# EAGLE design 16 ch sample-and-hold card v4_1_1 (EAGLE 9.6.2)
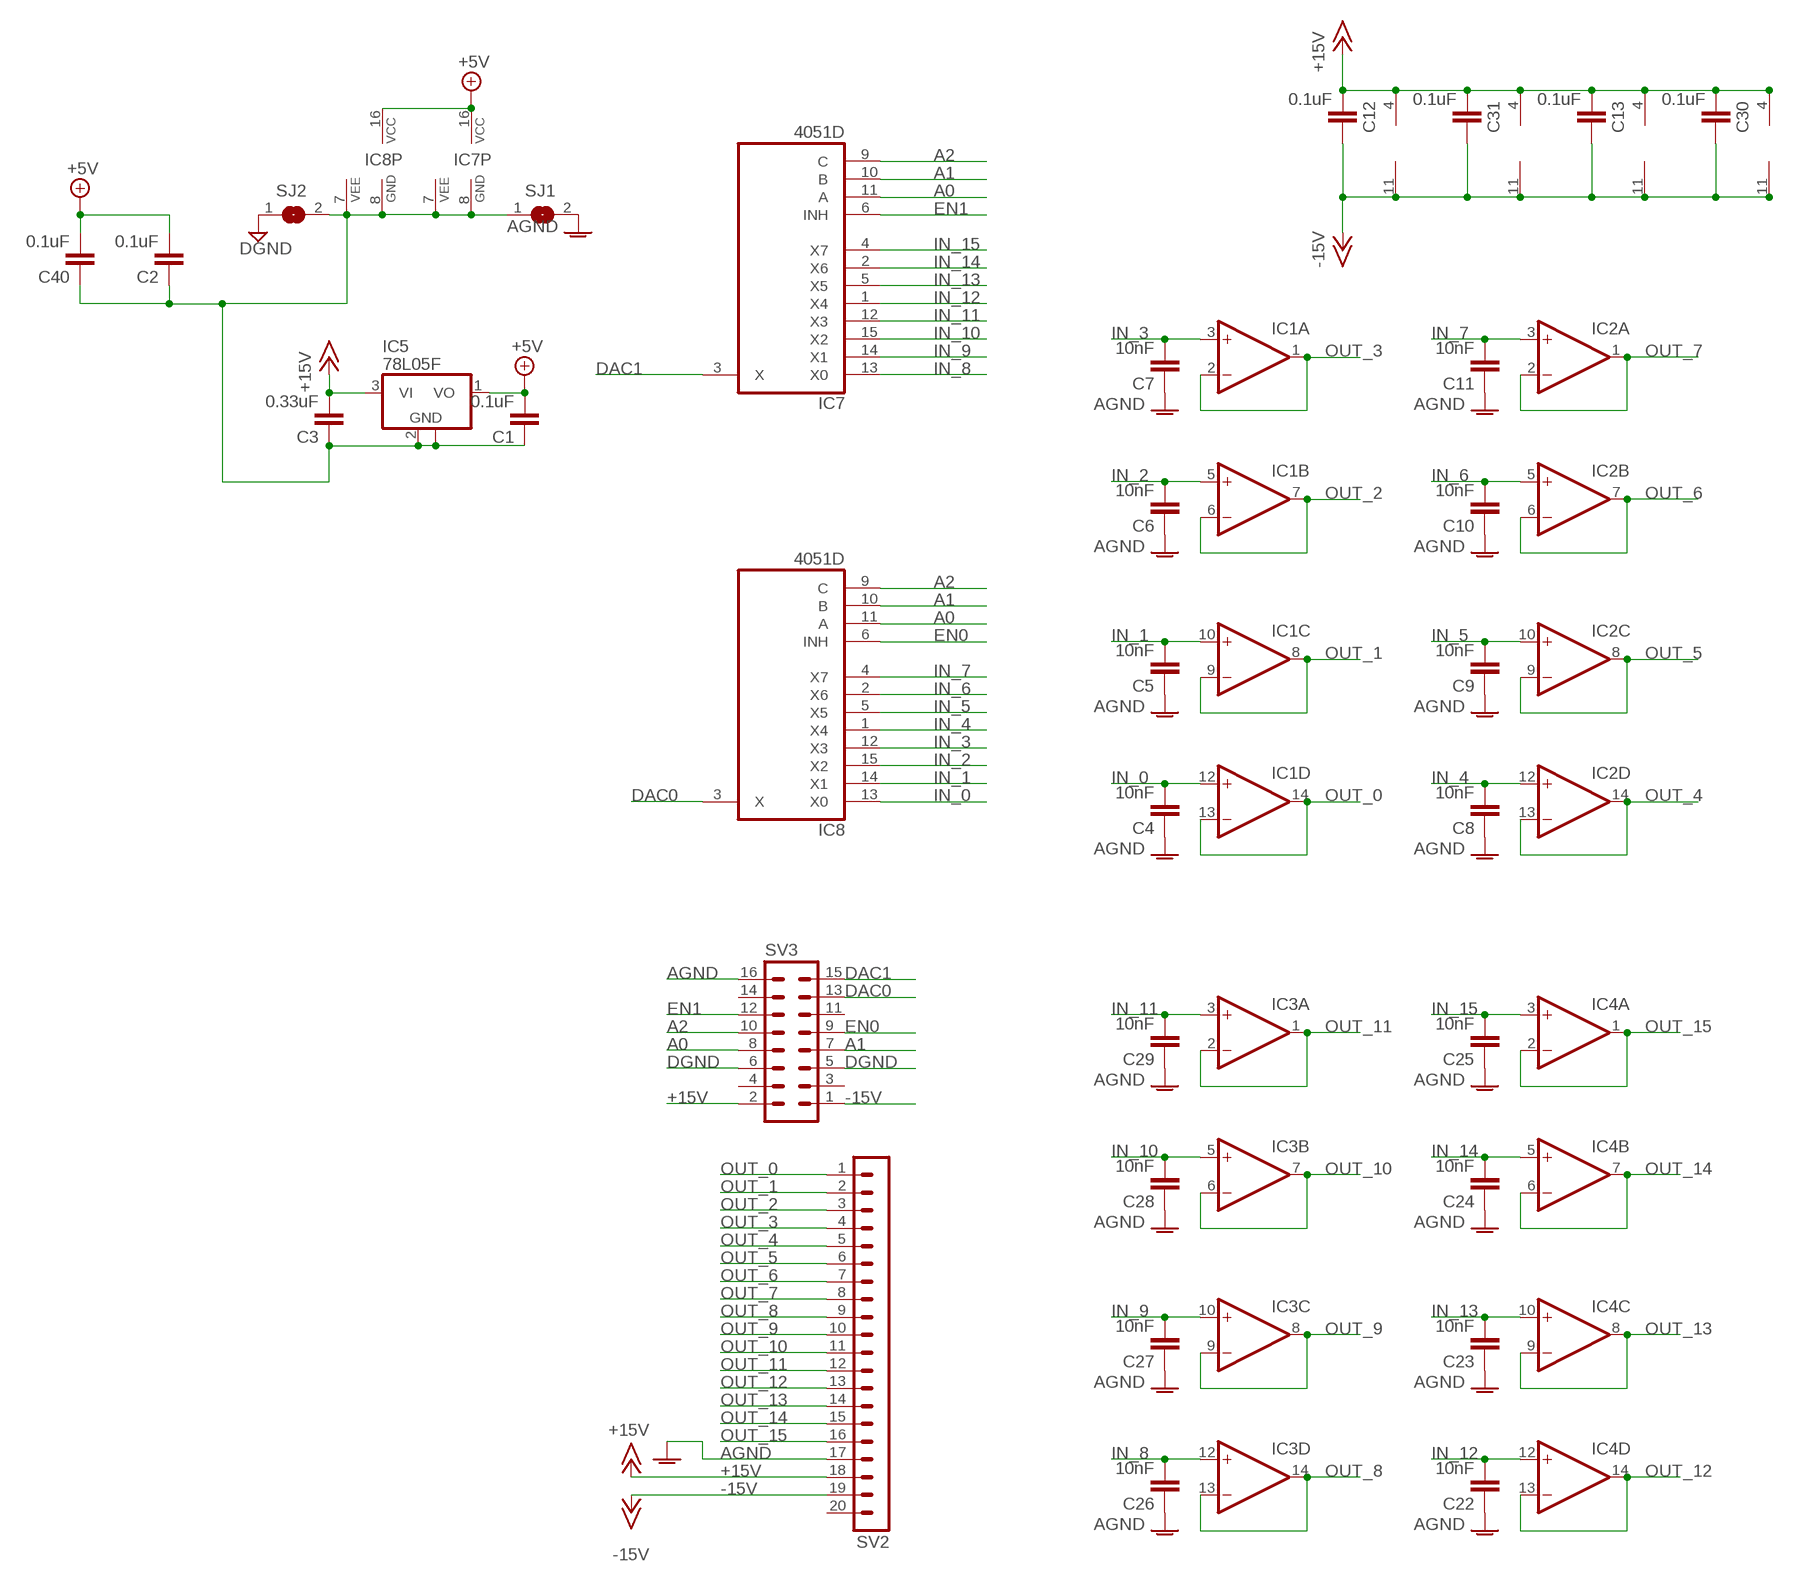
[diagram p0: schematic, sheet 1]

## Parts
C1  0.1uF  C-EUC0603  [C0603]
C2  0.1uF  C-EUC0603  [C0603]
C3  0.33uF  C-EUC0603  [C0603]
C4  10nF  C-EUC0805  [C0805]
C5  10nF  C-EUC0805  [C0805]
C6  10nF  C-EUC0805  [C0805]
C7  10nF  C-EUC0805  [C0805]
C8  10nF  C-EUC0805  [C0805]
C9  10nF  C-EUC0805  [C0805]
C10  10nF  C-EUC0805  [C0805]
C11  10nF  C-EUC0805  [C0805]
C12  0.1uF  C-EUC0603  [C0603]
C13  0.1uF  C-EUC0603  [C0603]
C22  10nF  C-EUC0805  [C0805]
C23  10nF  C-EUC0805  [C0805]
C24  10nF  C-EUC0805  [C0805]
C25  10nF  C-EUC0805  [C0805]
C26  10nF  C-EUC0805  [C0805]
C27  10nF  C-EUC0805  [C0805]
C28  10nF  C-EUC0805  [C0805]
C29  10nF  C-EUC0805  [C0805]
C30  0.1uF  C-EUC0603  [C0603]
C31  0.1uF  C-EUC0603  [C0603]
C40  0.1uF  C-EUC0603  [C0603]
IC1  TL074D  [SO14]
IC2  TL074D  [SO14]
IC3  TL074D  [SO14]
IC4  TL074D  [SO14]
IC5  78L05F  [SOT89]
IC7  4051D  [SO16]
IC8  4051D  [SO16]
SJ1  SJ  [SJ]
SJ2  SJ  [SJ]
SV2  MA20-1  [MA20-1]
SV3  MA08-2J  [MA08-2J]

## Nets
+5V: C1.2 C2.2 C40.2 IC5.1(VO) IC7.16(VCC) IC8.16(VCC)
+15V: C3.2 C12.1 C13.1 C30.1 C31.1 IC1.4(P:V+) IC2.4(P:V+) IC3.4(P:V+) IC4.4(P:V+) IC5.3(VI) SV2.18 SV3.2
-15V: C12.2 C13.2 C30.2 C31.2 IC1.11(P:V-) IC2.11(P:V-) IC3.11(P:V-) IC4.11(P:V-) SV2.19 SV3.1
A0: IC7.11(A) IC8.11(A) SV3.8
A1: IC7.10(B) IC8.10(B) SV3.7
A2: IC7.9(C) IC8.9(C) SV3.10
AGND: C4.1 C5.1 C6.1 C7.1 C8.1 C9.1 C10.1 C11.1 C22.1 C23.1 C24.1 C25.1 C26.1 C27.1 C28.1 C29.1 SJ1.2 SV2.17 SV3.16
DAC0: IC8.3(X) SV3.13
DAC1: IC7.3(X) SV3.15
DGND: SJ2.1 SV3.5 SV3.6
EN0: IC8.6(INH) SV3.9
EN1: IC7.6(INH) SV3.12
IN_0: C4.2 IC1.12(D:+IN) IC8.13(X0)
IN_1: C5.2 IC1.10(C:+IN) IC8.14(X1)
IN_2: C6.2 IC1.5(B:+IN) IC8.15(X2)
IN_3: C7.2 IC1.3(A:+IN) IC8.12(X3)
IN_4: C8.2 IC2.12(D:+IN) IC8.1(X4)
IN_5: C9.2 IC2.10(C:+IN) IC8.5(X5)
IN_6: C10.2 IC2.5(B:+IN) IC8.2(X6)
IN_7: C11.2 IC2.3(A:+IN) IC8.4(X7)
IN_8: C26.2 IC3.12(D:+IN) IC7.13(X0)
IN_9: C27.2 IC3.10(C:+IN) IC7.14(X1)
IN_10: C28.2 IC3.5(B:+IN) IC7.15(X2)
IN_11: C29.2 IC3.3(A:+IN) IC7.12(X3)
IN_12: C22.2 IC4.12(D:+IN) IC7.1(X4)
IN_13: C23.2 IC4.10(C:+IN) IC7.5(X5)
IN_14: C24.2 IC4.5(B:+IN) IC7.2(X6)
IN_15: C25.2 IC4.3(A:+IN) IC7.4(X7)
N$2: C1.1 C2.1 C3.1 C40.1 IC5.2(GND) IC5.2@1(GND) IC7.7(VEE) IC7.8(GND) IC8.7(VEE) IC8.8(GND) SJ1.1 SJ2.2
OUT_0: IC1.13(D:-IN) IC1.14(D:OUT) SV2.1
OUT_1: IC1.8(C:OUT) IC1.9(C:-IN) SV2.2
OUT_2: IC1.6(B:-IN) IC1.7(B:OUT) SV2.3
OUT_3: IC1.1(A:OUT) IC1.2(A:-IN) SV2.4
OUT_4: IC2.13(D:-IN) IC2.14(D:OUT) SV2.5
OUT_5: IC2.8(C:OUT) IC2.9(C:-IN) SV2.6
OUT_6: IC2.6(B:-IN) IC2.7(B:OUT) SV2.7
OUT_7: IC2.1(A:OUT) IC2.2(A:-IN) SV2.8
OUT_8: IC3.13(D:-IN) IC3.14(D:OUT) SV2.9
OUT_9: IC3.8(C:OUT) IC3.9(C:-IN) SV2.10
OUT_10: IC3.6(B:-IN) IC3.7(B:OUT) SV2.11
OUT_11: IC3.1(A:OUT) IC3.2(A:-IN) SV2.12
OUT_12: IC4.13(D:-IN) IC4.14(D:OUT) SV2.13
OUT_13: IC4.8(C:OUT) IC4.9(C:-IN) SV2.14
OUT_14: IC4.6(B:-IN) IC4.7(B:OUT) SV2.15
OUT_15: IC4.1(A:OUT) IC4.2(A:-IN) SV2.16
Unconnected: SV2.20 SV3.3 SV3.4 SV3.11 SV3.14

## Library data of the parts
C1-C3 C12 C13 C30 C31 C40 = resistor:C-EU: CAPACITOR, European symbol
C4-C11 C22-C29 = rcl:C-EU: CAPACITOR, European symbol; SPICEPREFIX: C
IC1-IC4 = linear:TL074: OP AMP
IC5 = linear:78L*: POSITOIV-VOLTAGE REGULATORS Output up to 100 mA Source: Datasheet <http://focus.ti.com/lit/ds/symlink/ua78l05.pdf>
IC7 IC8 = 40xx:4051: 8-channel ANALOG MULTIPLEXER
SJ1 SJ2 = jumper:SJ: SMD solder JUMPER
SV2 = joakim:MA20-1: PIN HEADER; OC_FARNELL: unknown; OC_NEWARK: unknown
SV3 = joakim:MA08-2J: PIN HEADER; OC_FARNELL: unknown; OC_NEWARK: unknown

## Board
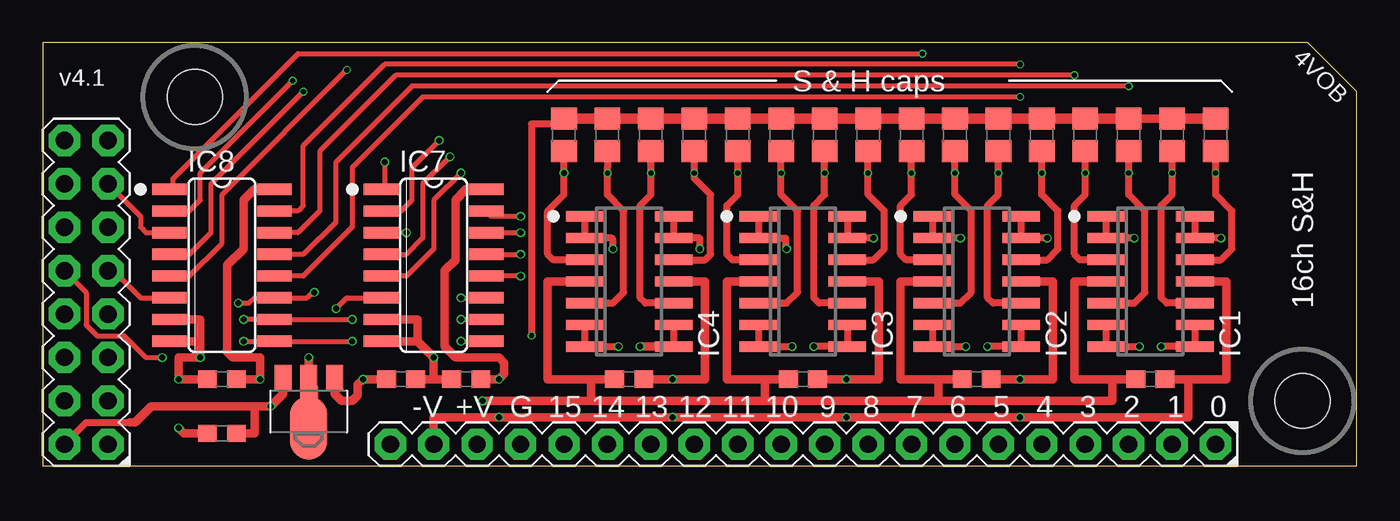
[diagram p1: board, top side]
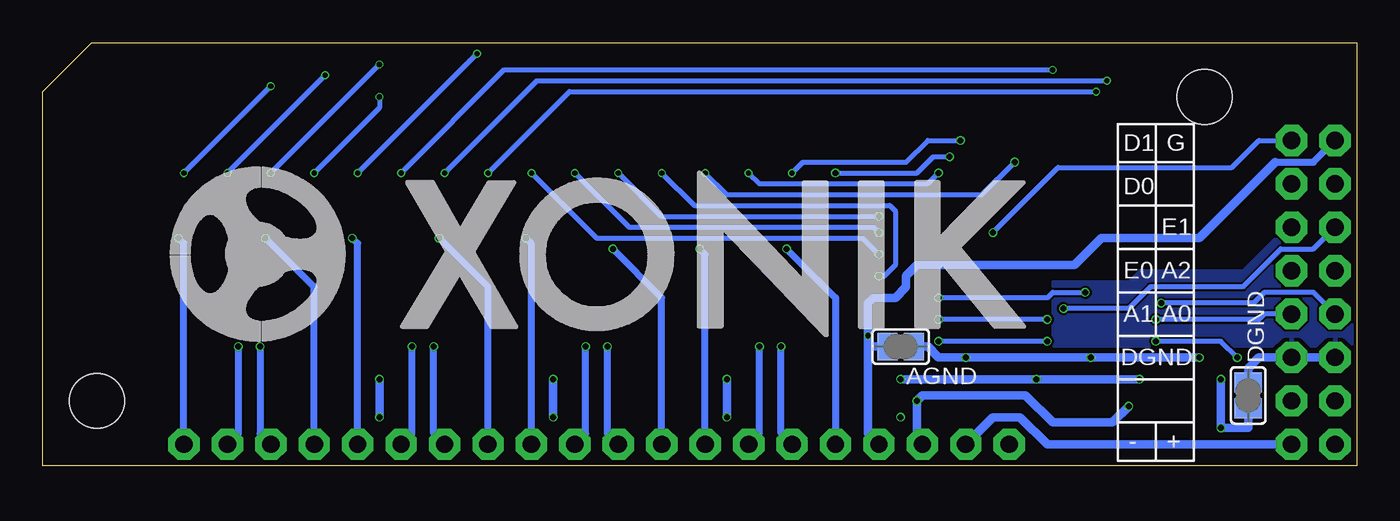
[diagram p2: board, bottom side, seen from below]

Size 76.83 x 24.77 mm. Coordinates in mm from the lower left corner, seen from the top.
Outline: 0,0 76.83,0 76.83,21.91 73.98,24.77 0,24.77 0,0
Copper layers (1*16): Top 0.035mm / dielectric 1.6mm / Bottom 0.035mm
Design rules "jlcpcb-2layers": minimum track width 5mil, minimum drill 0.3mm, track to track 5mil, track to pad 5mil, pad to pad 5mil, via to via 5mil, smd to smd 5mil, copper to edge 0.2mm, drill to drill 6mil, minimum pad ring 10mil, minimum via ring 3mil, stop-mask expansion 4mil, vias tented up to drill 0mil, thermal gap 10mil
Holes 3.2 mm at 8.89,21.59 73.66,3.81

### Footprints (pad centres in the part's own frame; a part is rotated, then mirrored left to right if it is on the bottom)
C0603 = smd 1.1 x 1: 1 -0.85,0; 2 0.85,0
C0805 = smd 1.3 x 1.5: 1 -0.95,0; 2 0.95,0
SO14 = smd 0.6 x 2.2: 1 -3.81,-2.6; 2 -2.54,-2.6; 3 -1.27,-2.6; 4 0,-2.6; 5 1.27,-2.6; 6 2.54,-2.6; 7 3.81,-2.6; 8 3.81,2.6; 9 2.54,2.6; 10 1.27,2.6; 11 0,2.6; 12 -1.27,2.6; 13 -2.54,2.6; 14 -3.81,2.6
SOT89 = smd 1 x 1.5: 1 -1.499,-1.981; 3 1.499,-1.981 | smd 1 x 2: 2 0,-1.727 | smd 2.2 x 3.7: 2@1 0,0.94
SO16 = smd 0.66 x 2.032: 1 -4.445,-3.073; 2 -3.175,-3.073; 3 -1.905,-3.073; 4 -0.635,-3.073; 5 0.635,-3.073; 6 1.905,-3.073; 7 3.175,-3.073; 8 4.445,-3.073; 9 4.445,3.073; 10 3.175,3.073; 11 1.905,3.073; 12 0.635,3.073; 13 -0.635,3.073; 14 -1.905,3.073; 15 -3.175,3.073; 16 -4.445,3.073
SJ = smd 1.168 x 1.6: 1 -0.762,0; 2 0.762,0
MA20-1 = drill 1.016 octagon: 1 -24.13,0; 2 -21.59,0; 3 -19.05,0; 4 -16.51,0; 5 -13.97,0; 6 -11.43,0; 7 -8.89,0; 8 -6.35,0; 9 -3.81,0; 10 -1.27,0; 11 1.27,0; 12 3.81,0; 13 6.35,0; 14 8.89,0; 15 11.43,0; 16 13.97,0; 17 16.51,0; 18 19.05,0; 19 21.59,0; 20 24.13,0
MA08-2J = drill 1.016 octagon: 1 -8.89,-1.27; 2 -8.89,1.27; 3 -6.35,-1.27; 4 -6.35,1.27; 5 -3.81,-1.27; 6 -3.81,1.27; 7 -1.27,-1.27; 8 -1.27,1.27; 9 1.27,-1.27; 10 1.27,1.27; 11 3.81,-1.27; 12 3.81,1.27; 13 6.35,-1.27; 14 6.35,1.27; 15 8.89,-1.27; 16 8.89,1.27

### Placement (x,y rotation side)
C1  20.95,5.08 180 top
C2  24.77,5.08 0 top
C3  10.48,1.91 0 top
C4  68.58,19.37 270 top
C5  66.04,19.37 270 top
C6  63.5,19.37 270 top
C7  60.96,19.37 270 top
C8  58.42,19.37 270 top
C9  55.88,19.37 270 top
C10  53.34,19.37 270 top
C11  50.8,19.37 270 top
C12  64.77,5.08 0 top
C13  54.61,5.08 0 top
C22  38.1,19.37 270 top
C23  35.56,19.37 270 top
C24  33.02,19.37 270 top
C25  30.48,19.37 270 top
C26  48.26,19.37 270 top
C27  45.72,19.37 270 top
C28  43.18,19.37 270 top
C29  40.64,19.37 270 top
C30  34.29,5.08 0 top
C31  44.45,5.08 0 top
C40  10.48,5.08 0 top
IC1  64.77,10.79 270 top
IC2  54.61,10.79 270 top
IC3  44.45,10.79 270 top
IC4  34.29,10.79 270 top
IC5  15.56,3.17 180 top
IC7  22.86,11.75 270 top
IC8  10.48,11.75 270 top
SJ1  26.67,6.99 180 bottom
SJ2  6.35,4.13 270 bottom
SV2  44.45,1.27 180 top
SV3  2.54,10.16 90 top
U$1  [XONIK_LOGO_50]  69.37,7.3 0 bottom

### Tracks (layer width: path | path; a pad name or v marks a point on that pad's centre or on a via)
+5V  (via drill 0.35)
  Top 0.508: IC7.16 24.77,16.19 24.13,15.56 24.13,12.06 23.5,11.43 23.5,6.99 24.13,6.35 26.67,6.35 26.99,6.03 26.99,5.4 v26.67,5.08 26.04,5.08 C2.2 | C40.2 v12.7,5.08 12.7,6.35 11.11,6.35 10.79,6.67 10.79,11.75 11.75,12.7 11.75,15.56 12.38,16.19 IC8.16 | IC5.1 17.06,4.22 17.46,3.81 18.1,3.81 18.41,4.13 18.41,4.76 v18.73,5.08 C1.2
  Bottom 0.508: v12.7,5.08 v18.73,5.08 v26.67,5.08
+15V  (via drill 0.35)
  Top 0.406: SV3.2 2.54,2.54 5.08,2.54
  Top 0.508: IC4.4 29.53,10.79 29.53,5.08 32.07,5.08 | 32.07,5.08 C30.1 | IC3.4 40.01,10.79 40.01,5.08 42.23,5.08 | 42.23,5.08 C31.1 | IC2.4 50.16,10.79 50.16,5.08 52.39,5.08 | 52.39,5.08 C13.1 | IC1.4 60.33,10.79 60.33,5.08 62.55,5.08 | 62.55,5.08 C12.1 | 32.07,5.08 32.07,3.81 | 42.23,5.08 42.23,3.81 | 42.23,3.81 32.07,3.81 | 42.23,3.81 52.39,3.81 | 52.39,3.81 52.39,5.08 | 52.39,3.81 62.55,3.81 62.55,5.08 | 32.07,3.81 v25.72,3.81 | 5.08,2.54 5.4,2.54 6.35,3.49 12.38,3.49 | 12.38,3.49 v13.34,3.49 14.06,4.22 IC5.3 | C3.2 12.38,1.91 12.38,3.49
  Bottom 0.508: SV2.18 25.72,1.59 v25.72,3.81 25.4,4.13 19.37,4.13 17.78,2.54 14.29,2.54 v13.34,3.49
-15V  (via drill 0.35)
  Top 0.508: IC4.11 38.73,10.79 38.73,5.08 v36.83,5.08 C30.2 | C31.2 v46.99,5.08 48.9,5.08 48.9,10.79 IC3.11 | C13.2 v57.15,5.08 59.05,5.08 59.05,10.79 IC2.11 | IC1.11 69.22,10.79 69.22,5.08 66.99,5.08 | C12.2 66.99,5.08 | 66.99,5.08 66.99,2.86 v57.15,2.86 v46.99,2.86 v36.83,2.86 v26.67,2.86 22.86,2.86 SV2.19
  Bottom 0.508: v57.15,5.08 v57.15,2.86 | v46.99,5.08 v46.99,2.86 | v36.83,5.08 v36.83,2.86 | SV3.1 18.1,1.27 19.68,2.86 21.27,2.86 SV2.19
A0  (via drill 0.35)
  Top 0.305: v11.43,9.53 12.06,9.53 12.38,9.84 IC8.11 15.46,9.84 15.77,10.16 v15.88,10.16 | v24.45,9.84 IC7.11
  Bottom 0.305: SV3.8 2.54,10.16 5.4,10.16 6.03,9.53 v11.43,9.53 | v15.88,10.16 17.78,10.16 18.1,9.84 v24.45,9.84
A1  (via drill 0.35)
  Top 0.305: v11.75,8.57 IC8.10 v18.1,8.57 | v24.45,8.57 IC7.10
  Bottom 0.305: SV3.7 5.4,8.89 5.71,8.57 v11.75,8.57 | v18.1,8.57 v24.45,8.57
A2  (via drill 0.35)
  Top 0.305: SV3.10 2.54,10.16 2.54,8.26 3.17,7.62 4.76,7.62 6.03,6.35 v6.99,6.35 | v24.45,7.3 IC7.9 | v11.75,7.3 IC8.9 v18.1,7.3
  Bottom 0.305: v18.1,7.3 v24.45,7.3 | v6.99,6.35 7.94,7.3 v11.75,7.3
AGND  (via drill 0.3)
  Top 0.406: C25.1 30.31,20.47 29.84,20 28.57,20 v28.57,7.62
  Top 0.508: C6.1 C5.1
  Top 0.61: C4.1 C5.1 | C6.1 C7.1 C8.1 C9.1 C10.1 C11.1 C26.1 C27.1 C28.1 C29.1 C22.1 C23.1 C24.1 C25.1
  Bottom 0.406: 4.76,17.78 2.54,17.78 SV3.16
  Bottom 0.508: 4.76,17.78 9.21,13.34 14.92,13.34 16.51,11.75 25.72,11.75 26.35,11.11 26.35,10.48 26.99,9.84 28.26,9.84 28.57,9.53 v28.57,7.62 28.57,6.99 | SV2.17 28.57,1.91 28.57,6.99 | SJ1.2 28.57,6.99
DAC0
  Top 0.305: SV3.13 5.71,14.61 5.71,13.97 6.03,13.65 IC8.3
DAC1  (via drill 0.35)
  Top 0.305: v21.27,13.65 IC7.3
  Bottom 0.305: v21.27,13.65 17.46,17.46 7.3,17.46 5.71,19.05 SV3.15
DGND
  Bottom 0.508: SJ2.1 6.35,5.71 5.71,6.35 SV3.5 SV3.6
  pour Bottom: -0.32,6.99 17.78,6.99 17.78,10.79 13.34,10.79 12.7,11.43 6.67,11.43 2.86,15.24 -0.32,15.24
EN0
  Top 0.305: SV3.9 4.13,11.43 5.71,9.84 IC8.6
EN1  (via drill 0.35)
  Top 0.305: v17.14,9.21 17.78,9.84 IC7.6
  Bottom 0.305: SV3.12 2.54,12.7 4.45,12.7 6.67,10.48 12.06,10.48 13.34,9.21 v17.14,9.21
IN_0  (via drill 0.3)
  Top 0.305: v68.58,17.14 C4.2 | v63.5,22.23 21.59,22.23 17.14,17.78 17.14,14.29 15.24,12.38 IC8.13
  Top 0.406: IC1.12 68.9,12.06 69.53,12.7 69.53,14.92 68.58,15.88 C4.2
  Bottom 0.305: v68.58,17.14 v63.5,22.23
IN_1  (via drill 0.3)
  Top 0.305: v66.04,17.14 C5.2 | v60.33,22.86 20.64,22.86 16.19,18.41 16.19,14.92 14.92,13.65 IC8.14
  Top 0.406: IC1.10 65.72,9.53 65.41,9.84 65.41,15.24 66.04,15.88 C5.2
  Bottom 0.305: v66.04,17.14 v60.33,22.86
IN_2  (via drill 0.3)
  Top 0.305: v63.5,17.14 C6.2 | v57.15,23.5 20,23.5 15.24,18.73 15.24,15.24 14.92,14.92 IC8.15
  Top 0.406: IC1.5 63.82,9.53 64.45,10.16 64.45,14.92 63.5,15.88 C6.2
  Bottom 0.305: v63.5,17.14 v57.15,23.5
IN_3  (via drill 0.3)
  Top 0.305: v60.96,17.14 C7.2 | IC8.12 15.24,11.11 18.1,13.97 18.1,17.46 22.23,21.59 v57.15,21.59
  Top 0.406: IC1.3 60.64,12.06 60.33,12.38 60.33,15.24 60.96,15.88 C7.2
  Bottom 0.305: v60.96,17.14 57.15,20.95 v57.15,21.59
IN_4  (via drill 0.3)
  Top 0.305: v58.42,17.14 C8.2 | IC8.1 7.62,16.19 7.62,16.83 14.92,24.13 v51.44,24.13
  Top 0.406: IC2.12 58.74,12.06 59.37,12.7 59.37,14.92 58.42,15.88 C8.2
  Bottom 0.305: v58.42,17.14 v51.44,24.13
IN_5  (via drill 0.3)
  Top 0.305: v55.88,17.14 C9.2 | IC8.5 8.57,11.11 10.48,13.02 10.48,15.88 v17.78,23.18
  Top 0.406: IC2.10 55.56,9.53 55.24,9.84 55.24,15.24 55.88,15.88 C9.2
  Bottom 0.305: v17.78,23.18 49.85,23.18 v55.88,17.14
IN_6  (via drill 0.3)
  Top 0.305: v53.34,17.14 C10.2 | IC8.2 8.57,14.92 9.21,15.56 9.21,17.14 v14.61,22.54
  Top 0.406: IC2.5 53.66,9.53 54.29,10.16 54.29,14.92 53.34,15.88 C10.2
  Bottom 0.305: v14.61,22.54 47.94,22.54 v53.34,17.14
IN_7  (via drill 0.3)
  Top 0.305: v50.8,17.14 C11.2 | IC8.4 8.57,12.38 9.84,13.65 9.84,16.51 v15.24,21.91
  Top 0.406: IC2.3 50.48,12.06 50.16,12.38 50.16,15.24 50.8,15.88 C11.2
  Bottom 0.305: v50.8,17.14 46.04,21.91 v15.24,21.91
IN_8  (via drill 0.3, 0.35)
  Top 0.305: v48.26,17.14 C26.2 | IC7.13 v27.94,12.38
  Top 0.406: IC3.12 48.58,12.06 49.21,12.7 49.21,14.92 48.26,15.88 C26.2
  Bottom 0.305: v48.26,17.14 44.45,13.34 28.89,13.34 v27.94,12.38
IN_9  (via drill 0.3, 0.35)
  Top 0.305: v45.72,17.14 C27.2 | IC7.14 v27.94,13.65
  Top 0.406: IC3.10 45.4,9.53 45.09,9.84 45.09,15.24 45.72,15.88 C27.2
  Bottom 0.305: v45.72,17.14 42.55,13.97 28.26,13.97 v27.94,13.65
IN_10  (via drill 0.3, 0.35)
  Top 0.305: v43.18,17.14 C28.2 | IC7.15 26.25,14.61 v27.94,14.61
  Top 0.406: IC3.5 43.5,9.53 44.13,10.16 44.13,14.92 43.18,15.88 C28.2
  Bottom 0.305: v43.18,17.14 40.64,14.61 v27.94,14.61
IN_11  (via drill 0.3, 0.35)
  Top 0.254: C29.2 40.64,18.1
  Top 0.305: v40.64,17.14 40.64,17.78 | v27.94,11.11 IC7.12
  Top 0.406: IC3.3 40.32,12.06 40.01,12.38 40.01,15.24 40.64,15.88 40.64,17.78 40.64,18.1
  Bottom 0.305: v40.64,17.14 38.73,15.24 27.3,15.24 26.99,14.92 26.99,11.75 27.62,11.11 v27.94,11.11
IN_12  (via drill 0.3, 0.35)
  Top 0.254: C22.2 38.1,18.1
  Top 0.305: v38.1,17.14 38.1,18.1 | v20,17.78 20,16.19 IC7.1
  Top 0.406: IC4.12 38.73,12.06 39.05,12.38 39.05,15.88 38.1,16.83 38.1,18.1
  Bottom 0.305: v38.1,17.14 36.83,15.88 21.91,15.88 v20,17.78
IN_13  (via drill 0.3, 0.35)
  Top 0.305: v24.45,17.14 22.86,15.56 22.86,12.7 21.27,11.11 IC7.5
  Top 0.406: IC4.10 35.24,9.53 34.92,9.84 34.92,15.24 35.56,15.88 v35.56,17.14 C23.2
  Bottom 0.305: v35.56,17.14 34.92,16.51 25.08,16.51 v24.45,17.14
IN_14  (via drill 0.3, 0.35)
  Top 0.305: v33.02,17.14 33.02,17.46 | IC7.2 20.95,14.92 21.59,15.56 21.59,17.46 v23.18,19.05
  Top 0.406: C24.2 33.02,17.46 33.02,15.88 33.97,14.92 33.97,10.16 33.34,9.53 IC4.5
  Bottom 0.305: v33.02,17.14 32.38,17.78 26.35,17.78 25.08,19.05 v23.18,19.05
IN_15  (via drill 0.35)
  Top 0.305: v30.48,17.14 C25.2 | IC7.4 21.27,12.38 22.23,13.34 22.23,16.51 v23.81,18.1
  Top 0.406: IC4.3 29.84,12.06 29.53,12.38 29.53,14.92 30.48,15.88 C25.2
  Bottom 0.305: v30.48,17.14 25.72,17.14 24.77,18.1 v23.81,18.1
N$2  (via drill 0.35)
  Top 0.508: C40.1 v7.94,5.08 7.94,6.35 v9.21,6.35 9.21,7.3 | IC5.2@1 15.56,1.91 15.88,1.59 15.88,4.58 IC5.2 v15.56,6.35 | 9.21,7.3 IC8.8 | IC8.7 9.21,8.57 9.21,7.3 | C1.1 22.86,5.08 | 22.86,5.08 C2.1 | 21.91,7.3 v22.86,6.35 22.86,5.08 | IC7.8 21.91,7.3 | 21.91,7.3 21.91,8.57 IC7.7 | C3.1 8.26,1.91 v7.94,2.22
  Bottom 0.508: v9.21,6.35 v15.56,6.35 v22.86,6.35 24.45,6.35 25.08,6.99 SJ1.1 | v7.94,5.08 v7.94,2.22 6.35,2.22 SJ2.2
OUT_0  (via drill 0.35)
  Top 0.406: IC1.14 IC1.13 v68.9,13.34
  Bottom 0.406: SV2.1 68.58,13.02 v68.9,13.34
OUT_1  (via drill 0.35)
  Top 0.406: IC1.9 IC1.8 v65.41,6.99
  Bottom 0.406: v65.41,6.99 65.41,1.91 SV2.2
OUT_2  (via drill 0.35)
  Top 0.406: IC1.6 IC1.7 v64.14,6.99
  Bottom 0.406: v64.14,6.99 64.14,1.91 SV2.3
OUT_3  (via drill 0.35)
  Top 0.406: IC1.2 IC1.1 62.17,13.39 62.23,13.34 v63.82,13.34
  Bottom 0.406: SV2.4 60.96,10.48 v63.82,13.34
OUT_4  (via drill 0.35)
  Top 0.406: v58.74,13.34 IC2.13 IC2.14
  Bottom 0.406: SV2.5 58.42,13.02 v58.74,13.34
OUT_5  (via drill 0.35)
  Top 0.406: IC2.9 IC2.8 v55.24,6.99
  Bottom 0.406: SV2.6 55.24,1.91 v55.24,6.99
OUT_6  (via drill 0.35)
  Top 0.406: IC2.6 IC2.7 v53.98,6.99
  Bottom 0.406: SV2.7 53.98,1.91 v53.98,6.99
OUT_7  (via drill 0.35)
  Top 0.406: IC2.1 IC2.2 v53.66,13.34
  Bottom 0.406: SV2.8 50.8,10.48 v53.66,13.34
OUT_8  (via drill 0.35)
  Top 0.406: IC3.14 IC3.13 v48.58,13.34
  Bottom 0.406: SV2.9 48.26,13.02 v48.58,13.34
OUT_9  (via drill 0.35)
  Top 0.406: IC3.9 IC3.8 v45.09,6.99
  Bottom 0.406: SV2.10 45.09,1.91 v45.09,6.99
OUT_10  (via drill 0.35)
  Top 0.406: IC3.6 IC3.7 v43.81,6.99
  Bottom 0.406: SV2.11 43.81,1.91 v43.81,6.99
OUT_11  (via drill 0.35)
  Top 0.406: IC3.1 IC3.2 43.44,13.34 43.44,12.76 v43.5,12.7
  Bottom 0.406: SV2.12 40.64,9.84 v43.5,12.7
OUT_12  (via drill 0.35)
  Top 0.406: IC4.14 IC4.13 38.42,13.34 v38.42,12.7
  Bottom 0.406: SV2.13 38.1,12.38 v38.42,12.7
OUT_13  (via drill 0.35)
  Top 0.406: IC4.9 IC4.8
  Top 0.508: v34.92,6.99 IC4.8
  Bottom 0.406: SV2.14 34.92,1.91 v34.92,6.99
OUT_14  (via drill 0.35)
  Top 0.406: IC4.6 IC4.7 v33.66,6.99
  Bottom 0.406: SV2.15 33.66,1.91 v33.66,6.99
OUT_15  (via drill 0.35)
  Top 0.406: IC4.1 IC4.2 33.28,13.34 33.34,13.28 v33.34,12.7
  Bottom 0.406: v33.34,12.7 30.48,9.84 SV2.16

### Text on the board
tNames: 4VOB | v4.1 | S & H caps | 16ch S&H | -V | +V | G | 15 | 14 | 13 | 12 | 11 | 10 | 9 | 8 | 7 | 6 | 5 | 4 | 3 | 2 | 1 | 0
bNames: G | D1 | D0 | E1 | A2 | E0 | A0 | A1 | DGND | DGND | AGND | + | -